# Altium schematic sheet 驱动电路1.SchDoc
size A4
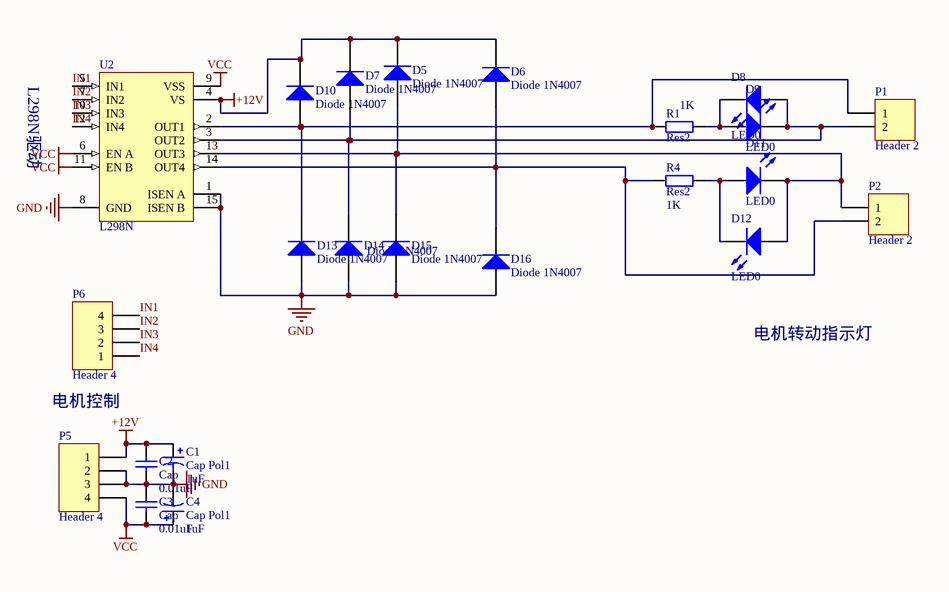
[diagram p0: 驱动电路1.SchDoc]

## Parts
C1  Cap Pol1  value 1uF  [RB7.6-15]
C2  Cap  value 0.01uF  [RAD-0.3]
C3  Cap  value 0.01uF  [RAD-0.3]
C4  Cap Pol1  value 1uF  [RB7.6-15]
D5  Diode 1N4007  [DO-41]
D6  Diode 1N4007  [DO-41]
D7  Diode 1N4007  [DO-41]
D8  LED0  [LED-0]
D9  LED0  [LED-0]
D10  Diode 1N4007  [DO-41]
D11  LED0  [LED-0]
D12  LED0  [LED-0]
D13  Diode 1N4007  [DO-41]
D14  Diode 1N4007  [DO-41]
D15  Diode 1N4007  [DO-41]
D16  Diode 1N4007  [DO-41]
P1  Header 2  [HDR1X2]
P2  Header 2  [HDR1X2]
P5  Header 4  [HDR1X4]
P6  Header 4  [HDR1X4]
R1  Res2  value 1K  [AXIAL-0.4]
R4  Res2  value 1K  [AXIAL-0.4]
U2  L298N  [Multiwatt15V]

## Nets
+12V: C1.1 C2.2 D5.2(K) D6.2(K) D7.2(K) D10.2(K) P5.1 U2.4(VS)
GND: C1.2 C2.1 C3.2 C4.2 D13.1(A) D14.1(A) D15.1(A) D16.1(A) P5.2 P5.3 U2.1(ISEN_A) U2.8(GND) U2.15(ISEN_B)
VCC: C3.1 C4.1 P5.4 U2.6(EN_A) U2.9(VSS) U2.11(EN_B)
IN1: P6.4 U2.5(IN1)
IN2: P6.3 U2.7(IN2)
IN3: P6.2 U2.10(IN3)
IN4: P6.1 U2.12(IN4)
NetD5_1: D5.1(A) D11.2(K) D12.1(A) D15.2(K) P2.1 U2.13(OUT3)
NetD6_1: D6.1(A) D16.2(K) P2.2 R4.1 U2.14(OUT4)
NetD7_1: D7.1(A) D8.1(A) D9.2(K) D14.2(K) P1.2 U2.3(OUT2)
NetD8_2: D8.2(K) D9.1(A) R1.2
NetD10_1: D10.1(A) D13.2(K) P1.1 R1.1 U2.2(OUT1)
NetD11_1: D11.1(A) D12.2(K) R4.2

## Notes on the sheet
- L298N驱动
- 电机控制
- 电机转动指示灯

## Library data of the parts
C1 C4 = Cap Pol1: Polarized Capacitor (Radial); Published: 8-Jun-2000; LatestRevisionDate: 17-Jul-2002; LatestRevisionNote: Re-released for DXP Platform.; PackageReference: RB7.6-15; Publisher: Altium Limited
C2 C3 = Cap: Capacitor; Published: 8-Jun-2000; LatestRevisionDate: 17-Jul-2002; LatestRevisionNote: Re-released for DXP Platform.; PackageReference: RAD-0.3; Publisher: Altium Limited
D5-D7 D10 D13-D16 = Diode 1N4007: 1 Amp General Purpose Rectifier; Published: 8-Jun-2000; LatestRevisionDate: 17-Jul-2002; LatestRevisionNote: Re-released for DXP Platform.; DatasheetDocument: 1998; PackageDocument: Aug-1999; PackageReference: DO-41; Publisher: Altium Limited; Code_JEDEC: DO-204-AL; ComponentLink1Description: Manufacturer Link; ComponentLink1URL: http://www.fairchildsemi.com/; ComponentLink2Description: Datasheet; ComponentLink2URL: http://www.fairchildsemi.com/ds/1N%2F1N4001.pdf
D8 D9 D11 D12 = LED0: Typical INFRARED GaAs LED; Published: 8-Jun-2000; LatestRevisionDate: 08-Jul-2005; LatestRevisionNote: Mech Layer 1 removed.; PackageReference: LED-0; Publisher: Altium Limited
P1 P2 = Header 2: Header, 2-Pin; LatestRevisionDate: 17-Jul-2002; LatestRevisionNote: Re-released for DXP Platform.; Publisher: Altium Limited
P5 P6 = Header 4: Header, 4-Pin; LatestRevisionDate: 17-Jul-2002; LatestRevisionNote: Re-released for DXP Platform.; Publisher: Altium Limited
R1 R4 = Res2: Resistor; Published: 8-Jun-2000; LatestRevisionDate: 17-Jul-2002; LatestRevisionNote: Re-released for DXP Platform.; PackageReference: AXIAL-0.4; Publisher: Altium Limited
U2 = L298N: Dual Full Bridge Driver; Published: 8-Jun-2000; LatestRevisionDate: 14-May-2007; LatestRevisionNote: Mapped to vertical PCB.; DatasheetVersion: Jul-1999; PackageReference: Multiwatt15V; Publisher: Altium Limited; PackageDescription: TO, Thru-Hole, Vertical, Heatsink Mounted; 15 Bent Staggered Leads; Pitch 1.27 mm; ComponentLink1Description: Manufacturer Link; ComponentLink1URL: http://www.st.com/; ComponentLink2Description: Datasheet; ComponentLink2URL: http://www.st.com/stonline/products/literature/ds/1773/l298.pdf